# EAGLE design 3d_printer_timer (EAGLE 7.6.0)
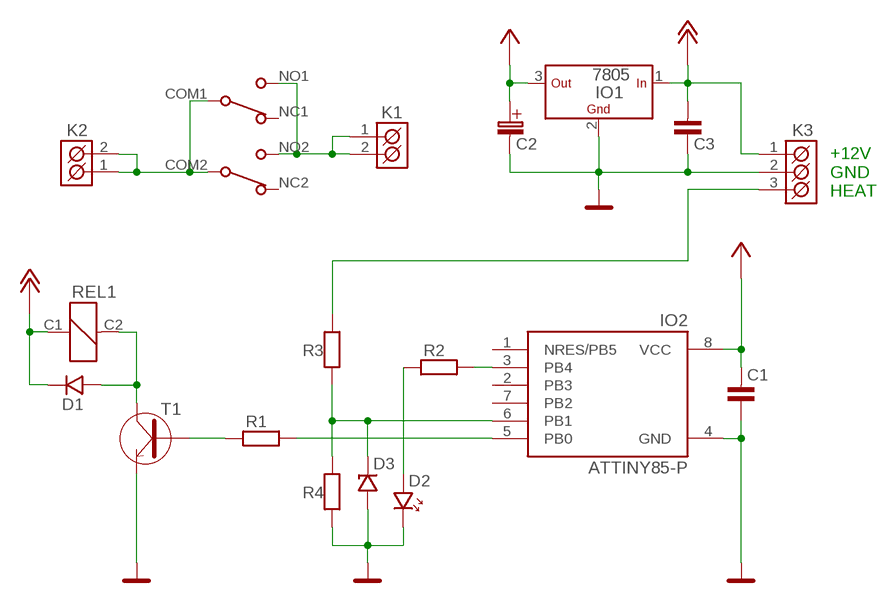
[diagram p0: schematic, sheet 1]

## Parts
C1  100n  C-KER_1206  [1206]
C2  100u  C-EL_2,5  [C-EL_2,5]
C3  100n  C-KER_1206  [1206]
D1  1N4148  D_7,5  [DO35]
D2  LED_3  [LED_3]
D3  5V1  D-BZX83V_0,5W-ZENER  [DO35]
IO1  7805  78_STO  [TO-220S]
IO2  ATTINY85-P  [PDIP08_300MIL]
K1  ARK500/2  [ARK500/2]
K2  ARK500/2  [ARK500/2]
K3  ARK500/3  [ARK500/3]
R1  1k  R_10  [R-10]
R2  330R  R_10  [R-10]
R3  R_10  [R-10]
R4  R_10  [R-10]
REL1  40.52  RELEMZPA92  [RELEMZPA92]
T1  BC546  [TO-92]

## Nets
+5V: C1.2 C2.C+(C_EL+) IO1.3(OUT) IO2.8(VCC)
+12V: C3.2 D1.K IO1.1(IN) K3.1(K1) REL1.C1(CIVKA:C1)
GND: C1.1 C2.C-(C_EL-) C3.1 D2.K D3.A IO1.2(GND) IO2.4(GND) K3.2(K2) R4.1 T1.3(E)
N$1: K2.1(K1) K2.2(K2) REL1.COM1(PREP1:COM) REL1.COM2(PREP2:COM)
N$2: K1.1(K1) K1.2(K2) REL1.NO1(PREP1:NO) REL1.NO2(PREP2:NO)
N$3: D1.A REL1.C2(CIVKA:C2) T1.1(C)
N$4: R1.1 T1.2(B)
N$6: IO2.5(PB0) R1.2
N$8: IO2.3(PB4) R2.2
N$9: D2.A R2.1
N$12: D3.K IO2.6(PB1) R3.1 R4.2
N$13: K3.3(K3) R3.2
Unconnected: IO2.1(NRES/PB5) IO2.2(PB3) IO2.7(PB2) REL1.NC1(PREP1:NC) REL1.NC2(PREP2:NC)

## Notes on the sheet
- +12V
  GND
  HEAT

## Library data of the parts
C1 C3 = #PaJa_31:C-KER: Kondenzator - keramicky
C2 = #PaJa_31:C-EL: Kondenzator - elektrolyticky
D1 = #PaJa_31:D: Dioda - univerzální
D2 = #PaJa_31:LED: LED - jednobarevna
D3 = #PaJa_31:D-?-ZENER: Zenerova dioda
IO1 = #PaJa_31:78?: Stabilizator - 1A a 1,5A ? - napeti => 05, 06, 08, 09, 12, 15, 18, 20, 24 => 1,5A ? - napeti => 10, 12, 15, 18 => 1A S ? - napeti => 05, 09, 10, 12, 15, 18, 24 => 2A T ? - napeti => 05 => 3A ------------------------------------------------------- Stabilizator - 100mA (TO-92 , SOT-89) ? - napeti => 02, 05, 06, 08, 09, 12, 15, 18
IO2 = attiny25_45_85:ATTINY85*: ATMEL ATtiny 85 Packages: P = PDIP 08 30mil S = SOIC 08 EIAJ 208mil Technologies Note: for complete ordering code (temp. range, finish, tape&reel etc.) see www.atmel.com • Supply Voltage: V = (1.8…5.5)V | [blank] = (2.7…5.5)V • Speed: 10 = 10 MHz | 20 = 20 MHz Author: Dipl.-Ing. FH Rainer Bayer HHN Hochschule Heilbronn (Heilbronn University), rainer.bayer@hs-heilbronn.de Ingenieurbüro ing-rb, mail@ing-rb.de
K1 K2 = #PaJa_konektory:ARK500/2: Svorkovnice - roztec 5mm - dvojita
K3 = #PaJa_konektory:ARK500/3: Svorkovnice - roztec 5mm - trojita
R1-R4 = #PaJa_31:R: Rezistor
REL1 = #PaJa_31:RELEMZPA92: RELE - 2x prepinaci, 5V, 12V, 24V max. spinany proud = 5A stejna roztec noh, rozmery (mimo vysku) a zapojeni jako rele RELE4061, RELEF4052 a RELEF4152
T1 = #PaJa_31:BC546: Tranzistor NPN - Univerzalni NF - Ic=0,1A

## Board
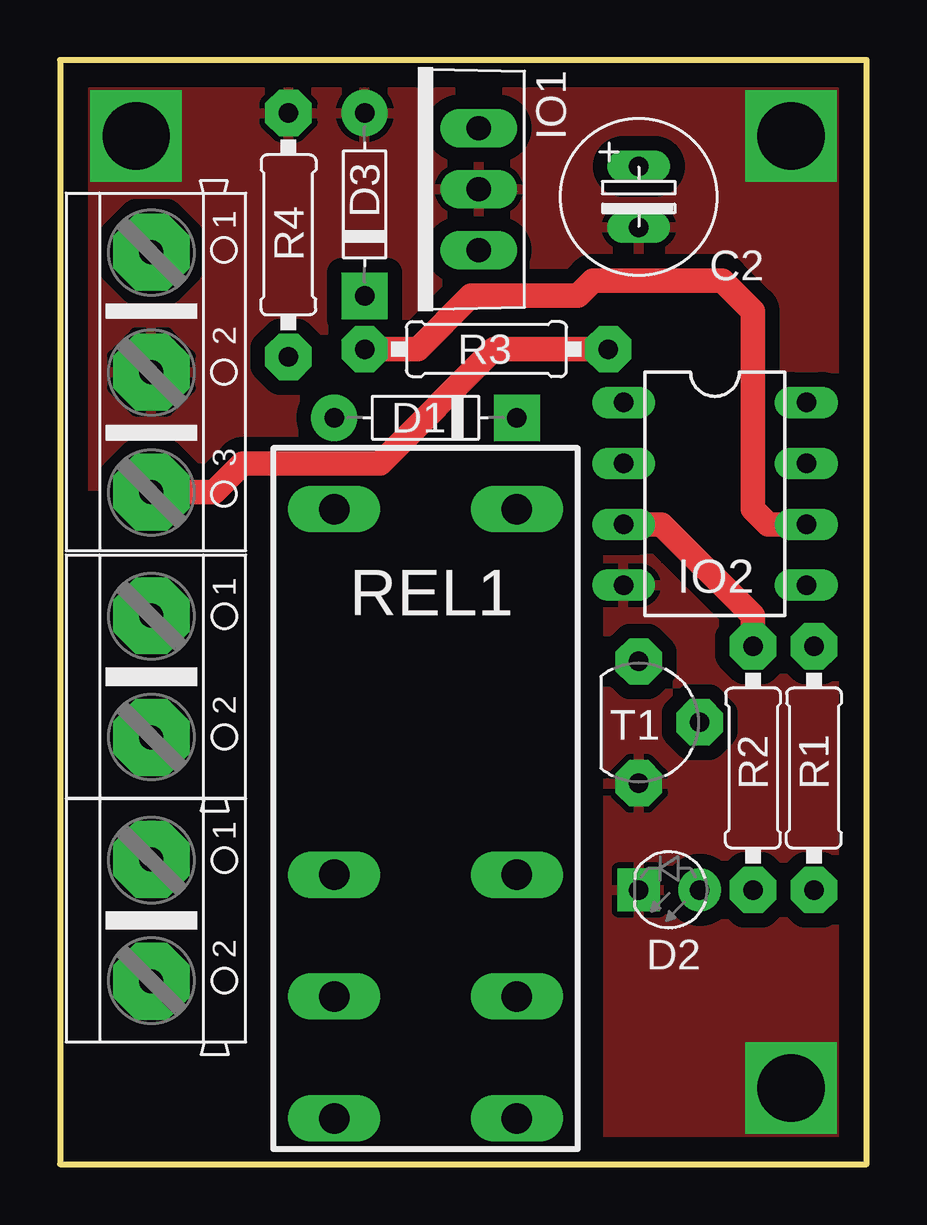
[diagram p1: board, top side]
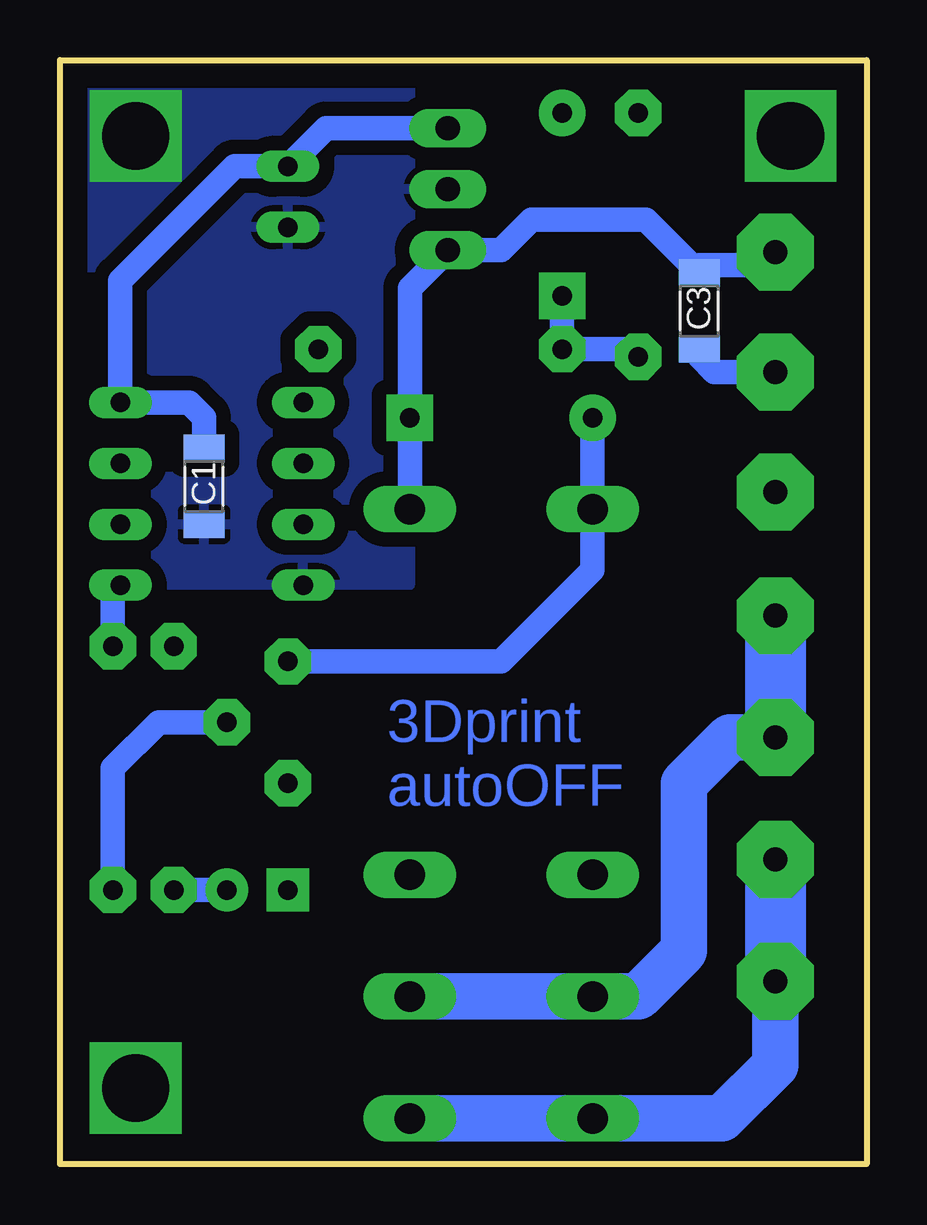
[diagram p2: board, bottom side, seen from below]

Size 33.63 x 46.02 mm. Coordinates in mm from the lower left corner, seen from the top.
Outline: 0,0 33.63,0 33.63,46.02 0,46.02 0,0
Copper layers (1*16): Top 0.035mm / dielectric 1.5mm / Bottom 0.035mm
Design rules "default": minimum track width 10mil, minimum drill 24mil, track to track 8mil, track to pad 8mil, pad to pad 8mil, via to via 8mil, smd to smd 8mil, copper to edge 40mil, drill to drill 8mil, minimum pad ring 10mil, minimum via ring 8mil, stop-mask expansion 4mil, vias tented up to drill 0mil, thermal gap 10mil

### Footprints (pad centres in the part's own frame; a part is rotated, then mirrored left to right if it is on the bottom)
1206 = smd 1.143 x 1.702: 1 -1.587,0; 2 1.587,0
C-EL_2,5 = drill 0.813 pad 1.27 long: C+ -1.27,0; C- 1.27,0
DO35 = drill 0.813 pad 1.93: A -3.81,0 | drill 0.813 pad 1.93 square: K 3.81,0
LED_3 = drill 0.813 pad 1.778: A -1.27,0 | drill 0.813 pad 1.778 square: K 1.27,0
TO-220S = drill 1.016 pad 1.6 long: 1 -2.54,0; 2 0,0; 3 2.54,0
PDIP08_300MIL = drill 0.813 long: 1 -3.81,-3.81; 2 -1.27,-3.81; 3 1.27,-3.81; 4 3.81,-3.81; 5 3.81,3.81; 6 1.27,3.81; 7 -1.27,3.81; 8 -3.81,3.81
ARK500/2 = drill 1 pad 3.2 octagon: 1 -2.54,0; 2 2.54,0
ARK500/3 = drill 1 pad 3.2 octagon: 1 -5,0; 2 0,0; 3 5,0
R-10 = drill 0.813 pad 1.93 octagon: 1 -5.08,0; 2 5.08,0
RELEMZPA92 = drill 1.27 pad 1.93 long: C1 -12.065,3.81; C2 -12.065,-3.81; COM1 8.255,-3.81; COM2 8.255,3.81; NC1 3.175,-3.81; NC2 3.175,3.81; NO1 13.335,-3.81; NO2 13.335,3.81
TO-92 = drill 0.813 pad 1.93 octagon: 1 0,2.54; 2 2.54,0; 3 0,-2.54

### Placement (x,y rotation side)
C1  27.62,28.26 90 bottom
C2  24.13,40.32 270 top
C3  6.99,35.56 90 bottom
D1  15.24,31.11 0 top
D2  25.4,11.43 180 top
D3  12.7,40.01 270 top
IO1  17.46,40.64 90 top
IO2  27.3,27.94 270 top
K1  3.81,10.16 270 top
K2  3.81,20.32 270 top
K3  3.81,33.02 270 top
R1  31.43,16.51 90 top
R2  28.89,16.51 90 top
R3  17.78,33.97 0 top
R4  9.53,38.73 270 top
REL1  15.24,15.24 270 top
T1  24.13,18.41 0 top

### Tracks (layer width: path | path; a pad name or v marks a point on that pad's centre or on a via)
+5V
  Bottom 1.016: IO1.3 22.54,43.18 C2.C+ 26.35,41.59 31.11,36.83 IO2.8 28.26,31.75 27.62,31.11 C1.2
+12V
  Bottom 1.016: REL1.C1 D1.K 19.05,36.51 IO1.1 15.24,38.1 13.97,39.37 9.21,39.37 C3.2 6.99,37.47 4.37,37.47 K3.1
GND  (via drill 2.8)
  Bottom 1.016: C3.1 6.99,33.66 6.35,33.02 K3.2
  other vias: 3.17,42.86 30.48,42.86 30.48,3.17
  pour Top (isolate 0.61): 0,46.04 33.66,46.04 33.66,0 22.86,0 22.86,28.26 0,28.26
  pour Bottom (isolate 0.61): 33.34,45.72 19.05,45.72 19.05,24.13 33.34,24.13
N$1
  Bottom 1.93: REL1.COM2 REL1.COM1 9.53,6.99 7.62,8.89 7.62,15.88 5.71,17.78 K2.2
  Bottom 2.54: K2.1 K2.2
N$2
  Bottom 1.93: REL1.NO2 REL1.NO1 6.03,1.91 3.81,4.13 K1.2
  Bottom 2.54: K1.1 K1.2
N$3
  Bottom 1.016: D1.A REL1.C2 11.43,24.77 15.24,20.95 T1.1
N$4
  Bottom 1.016: R1.1 31.43,16.51 29.53,18.41 T1.2
N$6
  Bottom 1.016: R1.2 31.43,23.81 IO2.5
N$8
  Top 1.016: R2.2 28.89,22.86 25.08,26.67 IO2.3
N$9
  Bottom 1.016: D2.A R2.1
N$12
  Top 1.016: R3.1 14.92,33.97 17.14,36.2 21.59,36.2 22.23,36.83 27.62,36.83 28.89,35.56 28.89,27.3 29.53,26.67 IO2.6
  Bottom 1.016: D3.K R3.1 10.16,33.97 R4.2
N$13
  Top 1.016: K3.3 6.43,28.02 7.62,29.21 13.34,29.21 18.1,33.97 R3.2

### Text on the board
Bottom: 3Dprint / autoOFF